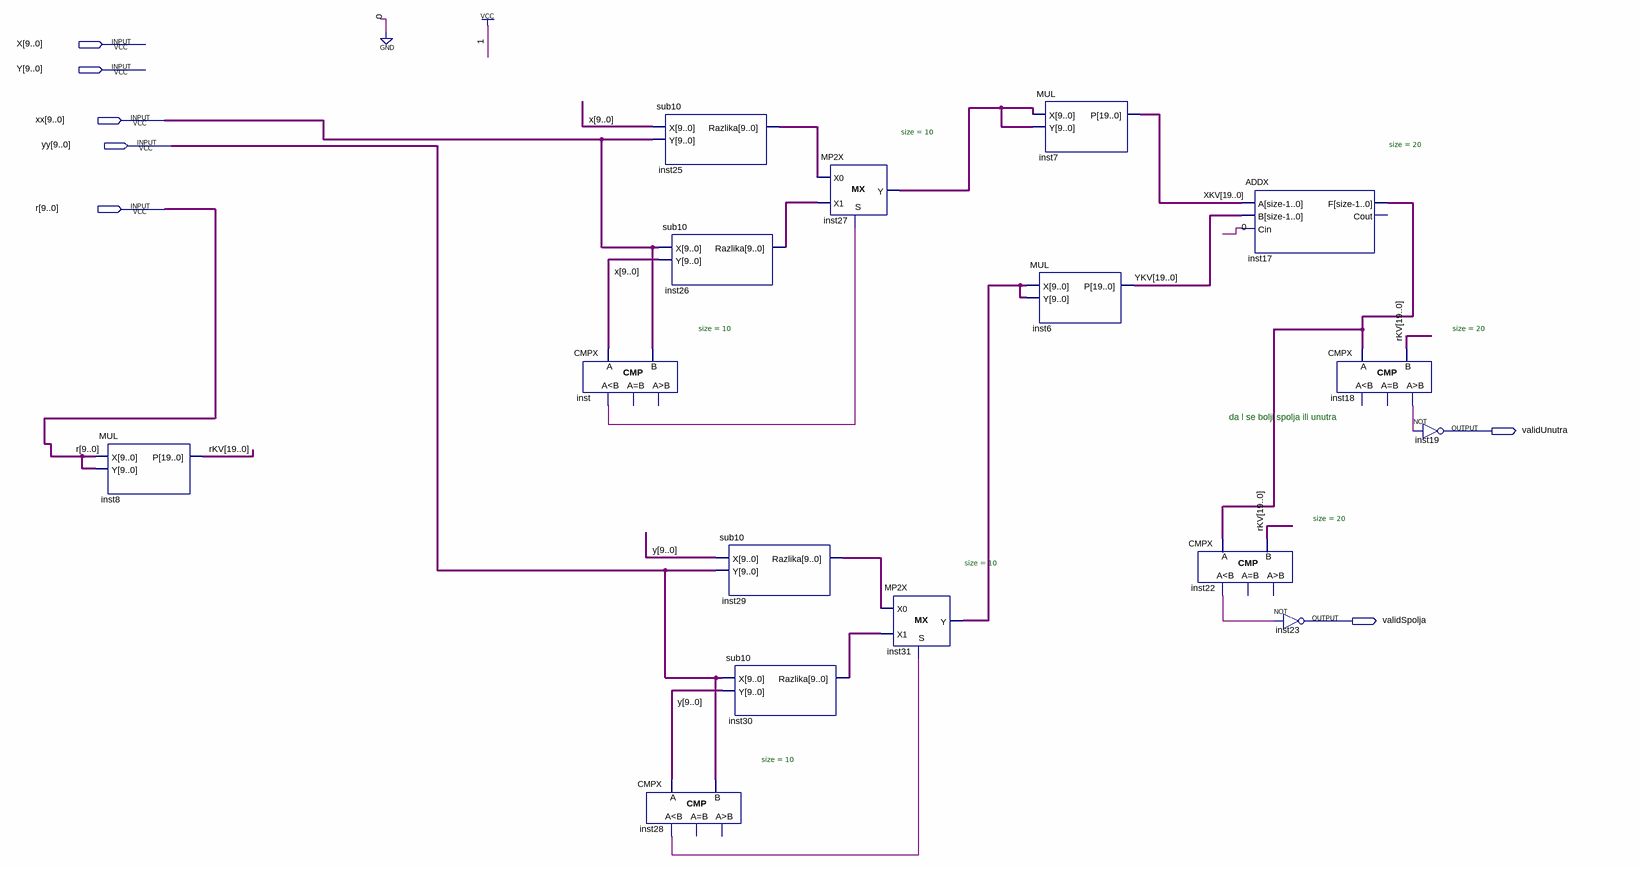
[diagram p0: schematic sheet]
// Quartus schematic krug2.bdf as structural Verilog: 16 symbols, 7 pins
module krug2 (
  input  [9:0] X,
  input  [9:0] Y,
  input  [9:0] xx,
  input  [9:0] yy,
  input  [9:0] r,
  output validUnutra,
  output validSpolja
);

  wire inst18_gr, inst22_ls, inst28_ls, inst_ls;
  wire [9:0] inst25_razlika, inst26_razlika, inst27_y, inst29_razlika, inst30_razlika, inst31_y;
  wire [19:0] inst17_f, rKV, XKV, YKV;

  MUL inst8 (.X(r), .Y(r), .P(rKV));
  CMPX #(.size(10)) inst (.A(X), .B(xx), .ls(inst_ls));  // open: eq, gr
  CMPX #(.size(10)) inst28 (.A(Y), .B(yy), .ls(inst28_ls));  // open: eq, gr
  sub10 inst25 (.X(X), .Y(xx), .Razlika(inst25_razlika));
  sub10 inst26 (.X(xx), .Y(X), .Razlika(inst26_razlika));
  sub10 inst29 (.X(Y), .Y(yy), .Razlika(inst29_razlika));
  sub10 inst30 (.X(yy), .Y(Y), .Razlika(inst30_razlika));
  MP2X #(.size(10)) inst27 (.S(inst_ls), .X0(inst25_razlika), .X1(inst26_razlika), .Y(inst27_y));
  MP2X #(.size(10)) inst31 (.S(inst28_ls), .X0(inst29_razlika), .X1(inst30_razlika), .Y(inst31_y));
  MUL inst7 (.X(inst27_y), .Y(inst27_y), .P(XKV));
  MUL inst6 (.X(inst31_y), .Y(inst31_y), .P(YKV));
  CMPX #(.size(20)) inst22 (.A(inst17_f), .B(rKV), .ls(inst22_ls));  // open: eq, gr
  ADDX #(.size(20)) inst17 (.A(XKV), .B(YKV), .Cin(1'b0), .F(inst17_f));  // open: Cout
  not inst23 (validSpolja, inst22_ls);
  CMPX #(.size(20)) inst18 (.A(inst17_f), .B(rKV), .gr(inst18_gr));  // open: ls, eq
  not inst19 (validUnutra, inst18_gr);

  // Notes on the sheet:
  //   da l se bolji spolja ili unutra
endmodule
